# EAGLE design BT AQ DOL R1 (EAGLE 9.6.2)
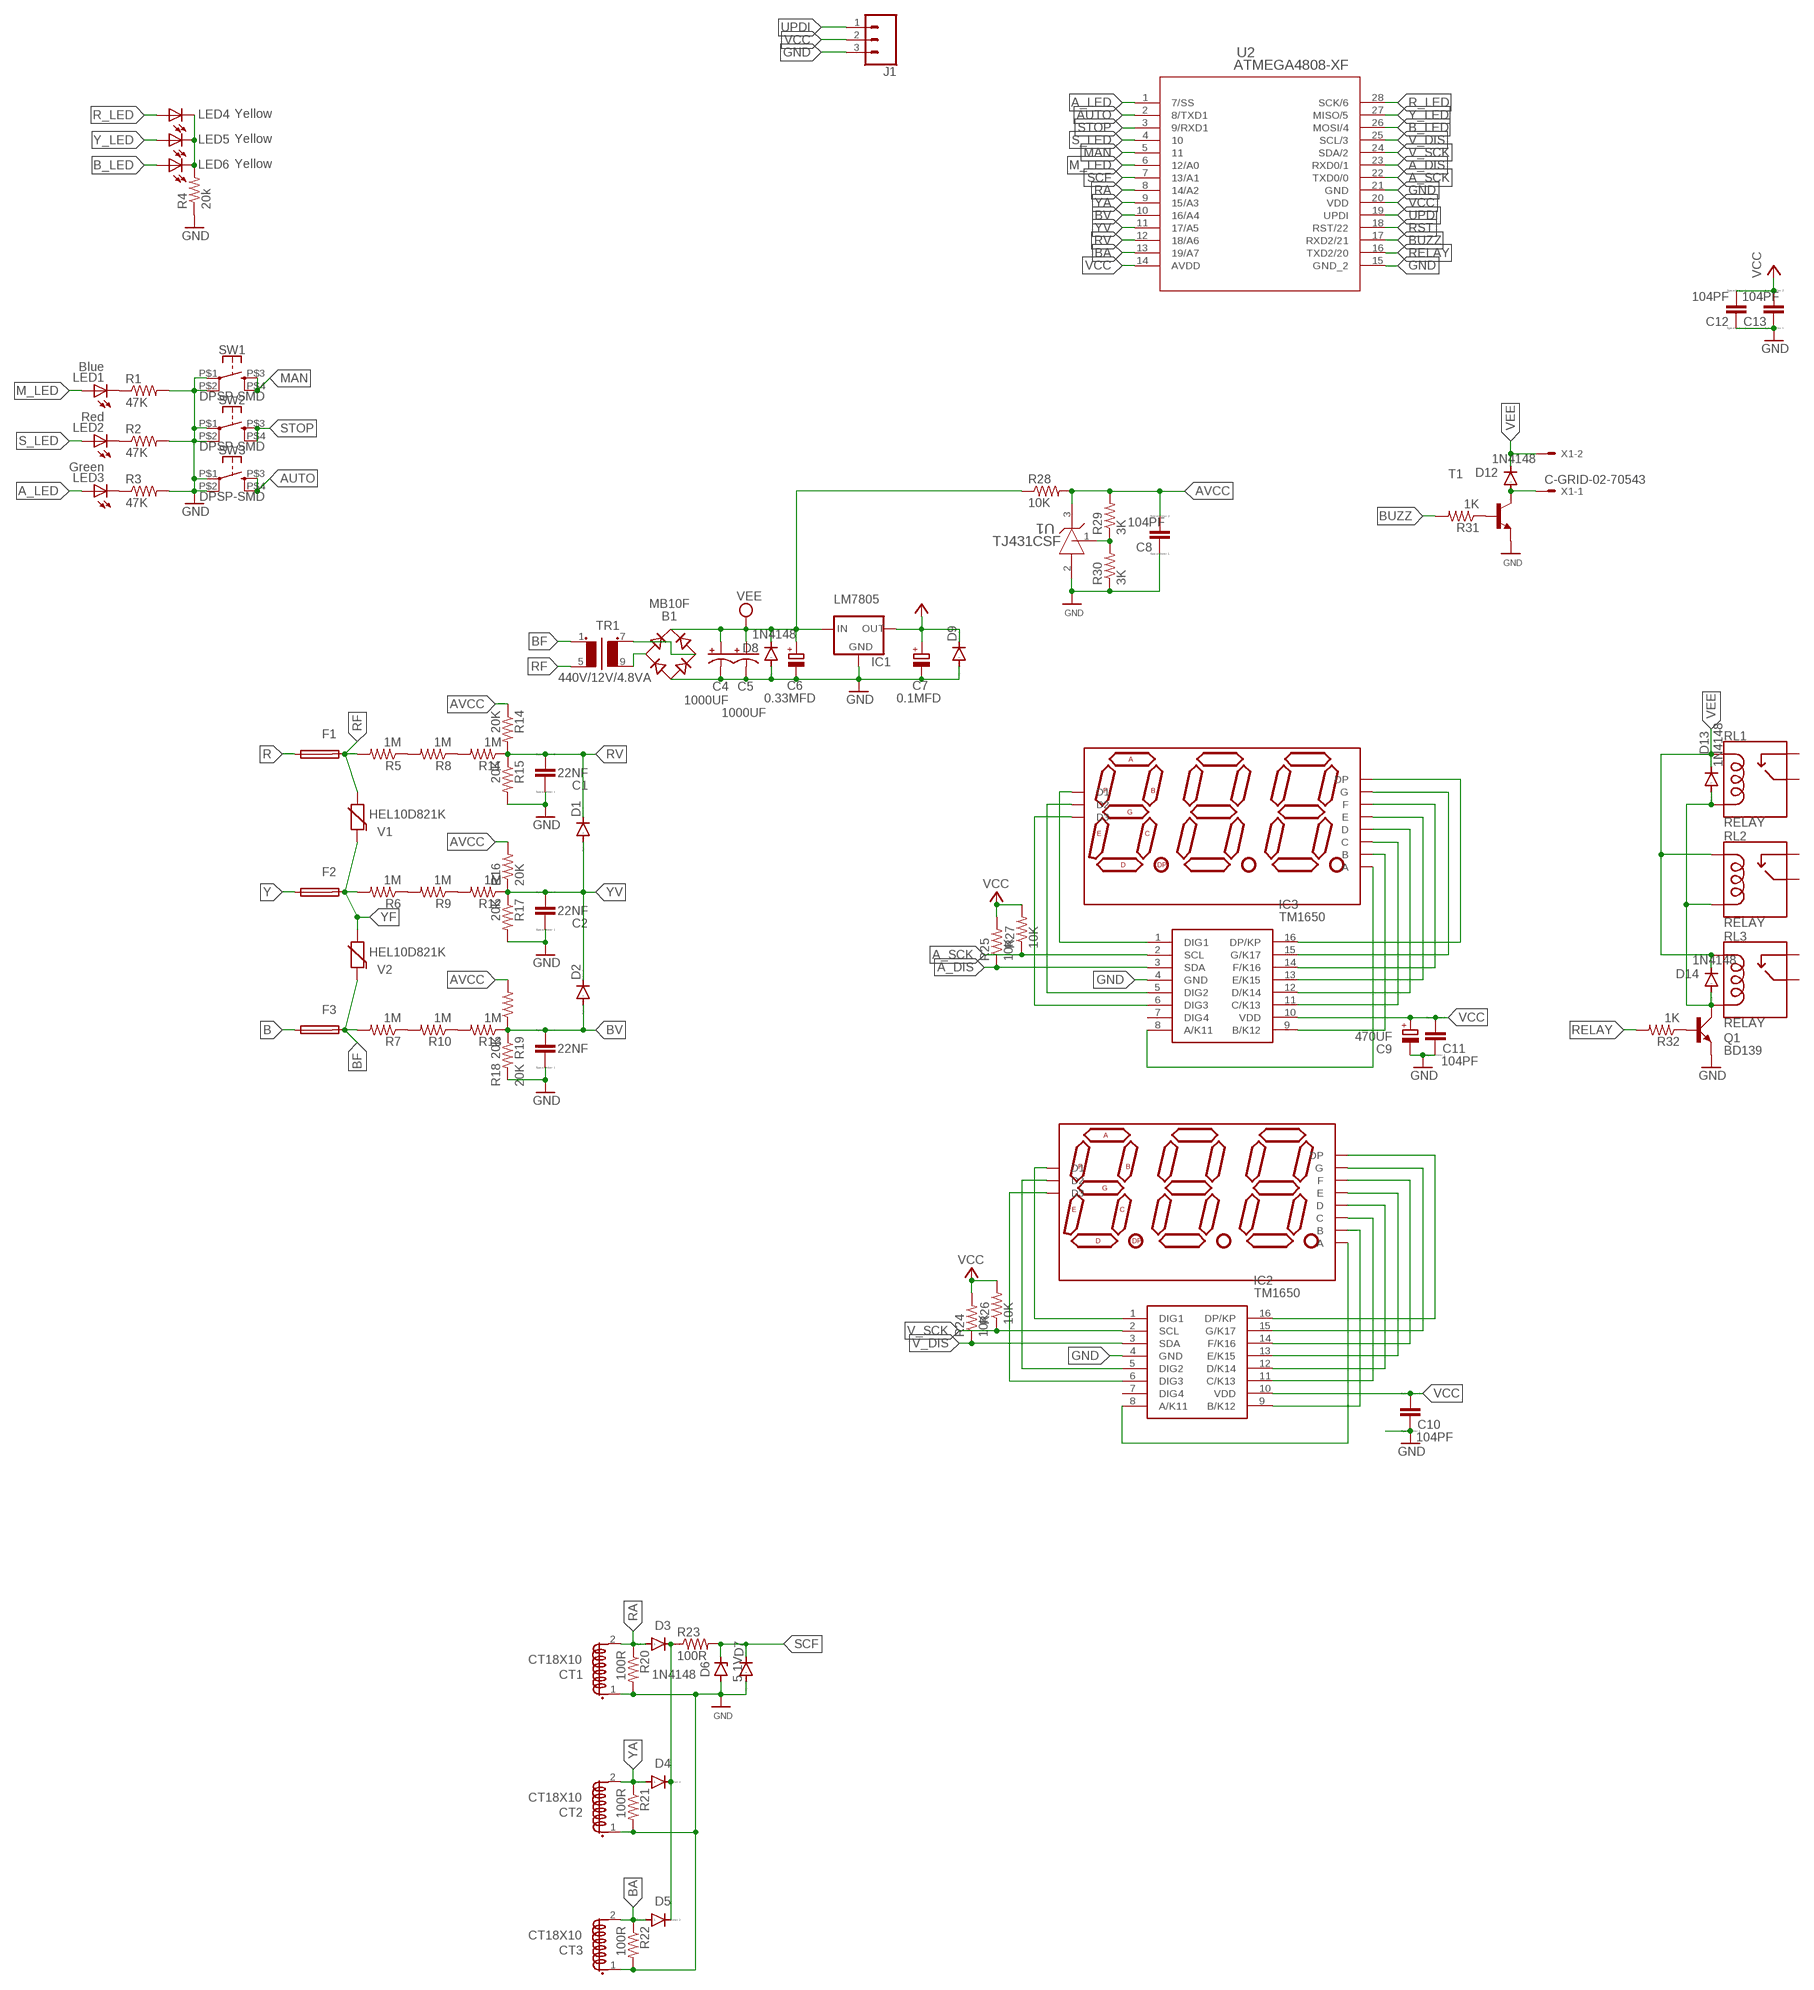
[diagram p0: schematic, sheet 1]

## Parts
B1  MB10F  MB8S  [SOIC-4]
C1  22NF  CC1206  [C1206]
C2  22NF  CC1206  [C1206]
C3  22NF  CC1206  [C1206]
C4  1000UF  CPOL-USE3.5-10  [E3,5-10]
C5  1000UF  CPOL-USE3.5-10  [E3,5-10]
C6  0.33MFD  CPOL-EUE2.5-5  [E2,5-5]
C7  0.1MFD  CPOL-EUE2.5-5  [E2,5-5]
C8  104PF  CC1206  [C1206]
C9  470UF  CPOL-EUE3.5-8  [E3,5-8]
C10  104PF  CC1206  [C1206]
C11  104PF  CC1206  [C1206]
C12  104PF  CC1206  [C1206]
C13  104PF  CC1206  [C1206]
CT1  CT18X10  [ZMCT103C]
CT2  CT18X10  [ZMCT103C]
CT3  CT18X10  [ZMCT103C]
D1  DIODE-DO214AA  [DO214AA]
D2  DIODE-DO214AA  [DO214AA]
D3  1N4148  DIODE-MINIMELF  [MINIMELF]
D4  1N4148  DIODE-MINIMELF  [MINIMELF]
D5  1N4148  DIODE-MINIMELF  [MINIMELF]
D6  5.1V  ZENER__DO-213AA(SOD-80)  [DIOMELF3516]
D7  DIODE-DO214AA  [DO214AA]
D8  1N4148  DIODE-MINIMELF  [MINIMELF]
D9  DIODE-DO214AA  [DO214AA]
D10  SUNR036CC3D  7SEGMENT-3DIGITDIP  [7S3D036_DIP]
D11  SUNR036CC3D  7SEGMENT-3DIGITDIP  [7S3D036_DIP]
D12  1N4148  DIODE-MINIMELF  [MINIMELF]
D13  1N4148  DIODE-DO-214AC  [DO-214AC]
D14  1N4148  DIODE-MINIMELF  [MINIMELF]
F1  TRF600-150  PPTCSMD  [TRF600-150-SMD]
F2  TRF600-150  PPTCSMD  [TRF600-150-SMD]
F3  TRF600-150  PPTCSMD  [TRF600-150-SMD]
IC1  LM7805  78XXS  [78XXS]
IC2  TM1650  [SOIC127P604X185-16N]
IC3  TM1650  [SOIC127P604X185-16N]
J1  CONN_03  [1X03]
LED1  Blue  LED3MM  [LED3MM]
LED2  Red  LED3MM  [LED3MM]
LED3  Green  LED3MM  [LED3MM]
LED4  Yellow  LED3MM  [LED3MM]
LED5  Yellow  LED3MM  [LED3MM]
LED6  Yellow  LED3MM  [LED3MM]
Q1  BD139  [TO126AV]
R1  47K  R-US_M1206  [M1206]
R2  47K  R-US_M1206  [M1206]
R3  47K  R-US_M1206  [M1206]
R4  20k  R-US_M1206  [M1206]
R5  1M  R-US_M1206  [M1206]
R6  1M  R-US_M1206  [M1206]
R7  1M  R-US_M1206  [M1206]
R8  1M  R-US_M1206  [M1206]
R9  1M  R-US_M1206  [M1206]
R10  1M  R-US_M1206  [M1206]
R11  1M  R-US_M1206  [M1206]
R12  1M  R-US_M1206  [M1206]
R13  1M  R-US_M1206  [M1206]
R14  20K  R-US_M1206  [M1206]
R15  20K  R-US_M1206  [M1206]
R16  20K  R-US_M1206  [M1206]
R17  20K  R-US_M1206  [M1206]
R18  20K  R-US_M1206  [M1206]
R19  20K  R-US_M1206  [M1206]
R20  100R  R-US_M1206  [M1206]
R21  100R  R-US_M1206  [M1206]
R22  100R  R-US_M1206  [M1206]
R23  100R  R-US_M1206  [M1206]
R24  10K  R-US_M1206  [M1206]
R25  10K  R-US_M1206  [M1206]
R26  10K  R-US_M1206  [M1206]
R27  10K  R-US_M1206  [M1206]
R28  10K  R-US_M1206  [M1206]
R29  3K  R-US_M1206  [M1206]
R30  3K  R-US_M1206  [M1206]
R31  1K  R-US_M1206  [M1206]
R32  1K  R-US_M1206  [M1206]
RL1  RELAY  [DT81_RECTANGULAR]
RL2  RELAY  [DT81_RECTANGULAR]
RL3  RELAY  [DT81_RECTANGULAR]
SW1  DPSP-SMD  [B3F-40XX-ROUND-SMD]
SW2  DPSP-SMD  [B3F-40XX-ROUND-SMD]
SW3  DPSP-SMD  [B3F-40XX-ROUND-SMD]
T1  MMUN2213LT1-NPN-SC59-BEC  [SC59-BEC]
TR1  440V/12V/4.8VA  TRANSFORMER6VA  [440V12V6VA]
U1  TJ431CSF  TJ431CSFDBZ0003A_L  [SOT-23]
U2  ATMEGA4808-XF  [SSOP28_SS_MCH]
V1  HEL10D821K  VARISTOR  [10MM]
V2  HEL10D821K  VARISTOR  [10MM]
X1  C-GRID-02-70543  [70543-02]

## Nets
A_DIS: IC3.3(SDA) R25.1 U2.23(RXD0/1)
A_LED: LED3.A U2.1(7/SS)
A_SCK: IC3.2(SCL) R27.1 U2.22(TXD0/0)
AUTO: SW3.P$3 SW3.P$4 U2.2(8/TXD1)
AVCC: C8.2 R14.1 R16.2 R18.2 R28.2 R29.2 U1.3(CATHODE)
B: F3.1
B_LED: LED6.A U2.26(MOSI/4)
BA: CT3.2(S1.2) D5.A R22.1 U2.13(19/A7)
BF: F3.2 R7.2 TR1.1 V2.1
BUZZ: R31.2 U2.17(RXD2/21)
BV: C3.2 D2.A R13.1 R18.1 R19.1 U2.10(16/A4)
GND: B1.- C1.1 C2.1 C3.1 C4.- C5.- C6.- C7.- C8.1 C9.- C10.1 C11.1 C12.1 C13.1 CT1.1(S1.1) CT2.1(S1.1) CT3.1(S1.1) D6.2(A) D7.A D8.A D9.A IC1.GND IC2.4(GND) IC3.4(GND) J1.3 Q1.E R1.2 R2.2 R3.2 R4.1 R15.2 R17.2 R19.2 R20.2 R21.2 R22.2 R30.1 SW1.P$1 SW1.P$2 SW2.P$1 SW2.P$2 SW3.P$1 SW3.P$2 T1.E U1.2(ANODE) U2.15(GND_2) U2.21(GND)
M_LED: LED1.A U2.6(12/A0)
MAN: SW1.P$3 SW1.P$4 U2.5
N$1: B1.~2(AC2) TR1.7(S1)
N$2: B1.~1(AC1) TR1.9(S2)
N$3: D12.A T1.C X1.1
N$4: R31.1 T1.B
N$5: LED3.K(C) R3.1
N$6: LED2.K(C) R2.1
N$8: LED1.K(C) R1.1
N$9: R29.1 R30.2 U1.1(REF)
N$13: R5.1 R8.2
N$14: R8.1 R11.2
N$15: R6.1 R9.2
N$18: R7.1 R10.2
N$19: R9.1 R12.2
N$22: Q1.B R32.1
N$23: R10.1 R13.2
N$28: D11.11(A) IC3.8(A/K11)
N$29: D11.7(B) IC3.9(B/K12)
N$30: D11.4(C) IC3.11(C/K13)
N$31: D11.2(D) IC3.12(D/K14)
N$32: D11.1(E) IC3.13(E/K15)
N$33: D11.10(F) IC3.14(F/K16)
N$34: D11.5(G) IC3.15(G/K17)
N$35: D11.3(DP) IC3.16(DP/KP)
N$36: D11.12(D1) IC3.1(DIG1)
N$37: D11.9(D2) IC3.5(DIG2)
N$38: D11.8(D3) IC3.6(DIG3)
N$39: D10.11(A) IC2.8(A/K11)
N$40: D10.7(B) IC2.9(B/K12)
N$41: D10.4(C) IC2.11(C/K13)
N$42: D3.C D4.C D5.C R23.1
N$44: D10.2(D) IC2.12(D/K14)
N$45: LED4.K(C) LED5.K(C) LED6.K(C) R4.2
N$48: D10.1(E) IC2.13(E/K15)
N$49: D10.10(F) IC2.14(F/K16)
N$50: D10.5(G) IC2.15(G/K17)
N$51: D10.3(DP) IC2.16(DP/KP)
N$52: D10.12(D1) IC2.1(DIG1)
N$53: D10.9(D2) IC2.5(DIG2)
N$54: D10.8(D3) IC2.6(DIG3)
N$121: D13.A D14.A Q1.C RL1.2(COIL2) RL1.2.(COIL2) RL2.2(COIL2) RL2.2.(COIL2) RL3.2(COIL2) RL3.2.(COIL2)
R: F1.1
R_LED: LED4.A U2.28(SCK/6)
RA: CT1.2(S1.2) D3.A R20.1 U2.8(14/A2)
RELAY: R32.2 U2.16(TXD2/20)
RF: F1.2 R5.2 TR1.5(P2) V1.2
RST: U2.18(RST/22)
RV: C1.2 D1.C R11.1 R14.2 R15.1 U2.12(18/A6)
S_LED: LED2.A U2.4
SCF: D6.1(C) D7.C R23.2 U2.7(13/A1)
STOP: SW2.P$3 SW2.P$4 U2.3(9/RXD1)
UPDI: J1.1 U2.19(UPDI)
V_DIS: IC2.3(SDA) R24.1 U2.25(SCL/3)
V_SCK: IC2.2(SCL) R26.1 U2.24(SDA/2)
VCC: C7.+ C9.+ C10.2 C11.2 C12.2 C13.2 D9.C IC1.OUT IC2.10(VDD) IC3.10(VDD) J1.2 R24.2 R25.2 R26.2 R27.2 U2.14(AVDD) U2.20(VDD)
VEE [VEE]: B1.+ C4.+ C5.+ C6.+ D8.C D12.C D13.C D14.C IC1.IN R28.1 RL1.1(COIL1) RL1.1.(COIL1) RL2.1(COIL1) RL2.1.(COIL1) RL3.1(COIL1) RL3.1.(COIL1) X1.2
Y: F2.1
Y_LED: LED5.A U2.27(MISO/5)
YA: CT2.2(S1.2) D4.A R21.1 U2.9(15/A3)
YF: F2.2 R6.2 V1.1 V2.2
YV: C2.2 D1.A D2.C R12.1 R16.1 R17.1 U2.11(17/A5)
Unconnected: IC2.7(DIG4) IC3.7(DIG4) RL1.C(MAIN) RL1.C.(MAIN) RL1.NO(N0) RL1.NO.(N0) RL2.C(MAIN) RL2.C.(MAIN) RL2.NO(N0) RL2.NO.(N0) RL3.C(MAIN) RL3.C.(MAIN) RL3.NO(N0) RL3.NO.(N0)

## Library data of the parts
B1 = rectifier:MB*S: Bridge Rectifier Source: http://www.fairchildsemi.com/ds/MB/MB6S.pdf
C1-C3 C8 C10-C13 = eagle-ltspice:C: CAPACITOR, European symbol; SPICEMODEL: NONE; SPICEPREFIX: C
C4 C5 = rcl:CPOL-US: POLARIZED CAPACITOR, American symbol; SPICEPREFIX: C
C6 C7 C9 = rcl:CPOL-EU: POLARIZED CAPACITOR, European symbol; SPICEPREFIX: C
CT1-CT3 = User Components:CT
D1-D5 D7-D9 D12-D14 = diode:DIODE-: DIODE
D6 = Tinkercad:ZENER: Zener Diode - Generic; CATEGORY: Diode; SUB-CATEGORY: Zener; VALUE: ZENER
D10 D11 = User Components:7SEGMENT-3DIGIT
F1-F3 = User Components:PPTC: FUSE Wickmann
IC1 = v-reg:78XXS: VOLTAGE REGULATOR
IC2 IC3 = User Components:TM1650: The TM1650 is a dedicated LED (LED display) drive control circuit with a keyboard scan interface. The MCU input and output control digital interface, data latch, LED driver, keyboard scan, brightness adjustment and other circuits are integrated inside. The TM1650's stable performance, reliable quality, and high immunity to interference make it suitable for long-term continuous operation in 24 hours Source: Datasheet <http://www.titanmec.com/index.php/en/product/download/id/540.html>; DESCRIPTION: The TM1650 is a dedicated LED (LED display) drive control circuit with a keyboard scan interface. The MCU input and output control digital interface, data latch, LED driver, keyboard scan, brightness adjustment and other circuits are integrated inside. The TM1650's stable performance, reliable quality, and high immunity to interference make it suitable for long-term continuous operation in 24 hours; HEIGHT: 1.85mm; MANUFACTURER_NAME: TITAN MICRO ELECTRONICS; MANUFACTURER_PART_NUMBER: tm1650
J1 = SparkFun-Connectors:CONN_03: Multi connection point. Often used as Generic Header-pin footprint for 0.1 inch spaced/style header connections On any of the 0.1 inch spaced packages, you can populate with these: Break Away Headers - Straight <https://www.sparkfun.com/products/116> (PRT-00116) Break Away Male Headers - Right Angle <https://www.sparkfun.com/products/553> (PRT-00553) Female Headers <https://www.sparkfun.com/products/115> (PRT-00115) Break Away Headers - Machine Pin <https://www.sparkfun.com/products/117> (PRT-00117) Break Away Female Headers - Swiss Machine Pin <https://www.sparkfun.com/products/743> (PRT-00743) Stackable Header - 3 Pin (Female, 0.1") <https://www.sparkfun.com/products/13875> (PRT-13875) For SCREWTERMINALS and SPRING TERMINALS visit here: Screw Terimnals on SparkFun.com <https://www.sparkfun.com/search/results?term=Screw+Terminals> (5mm/3.5mm/2.54mm spacing) This device is also useful as a general connection point to wire up your design to another part of your project. Our various solder wires solder well into these plated through hole pads. Hook-Up Wire - Assortment (Stranded, 22 AWG) <https://www.sparkfun.com/products/11375> (PRT-11375) Hook-Up Wire - Assortment (Solid Core, 22 AWG) <https://www.sparkfun.com/products/11367> (PRT-11367) View the entire wire category on our website here <https://www.sparkfun.com/categories/141> Special notes: Molex polarized connector foot print use with SKU : PRT-08232 with associated crimp pins and housings.
LED1-LED6 = adafruit:LED: LED OSRAM: - CHIPLED LG R971, LG N971, LY N971, LG Q971, LY Q971, LO R971, LY R971 LH N974, LH R974 LS Q976, LO Q976, LY Q976 LO Q996 - Hyper CHIPLED LW Q18S LB Q993, LB Q99A, LB R99A - SideLED LS A670, LO A670, LY A670, LG A670, LP A670 LB A673, LV A673, LT A673, LW A673 LH A674 LY A675 LS A676, LA A676, LO A676, LY A676, LW A676 LS A679, LY A679, LG A679 - Hyper Micro SIDELED® LS Y876, LA Y876, LO Y876, LY Y876 LT Y87S - SmartLED LW L88C, LW L88S LB L89C, LB L89S, LG L890 LS L89K, LO L89K, LY L89K LS L896, LA L896, LO L896, LY L896 - TOPLED LS T670, LO T670, LY T670, LG T670, LP T670 LSG T670, LSP T670, LSY T670, LOP T670, LYG T670 LG T671, LOG T671, LSG T671 LB T673, LV T673, LT T673, LW T673 LH T674 LS T676, LA T676, LO T676, LY T676, LB T676, LH T676, LSB T676, LW T676 LB T67C, LV T67C, LT T67C, LS T67K, LO T67K, LY T67K, LW E67C LS E67B, LA E67B, LO E67B, LY E67B, LB E67C, LV E67C, LT E67C LW T67C LS T679, LY T679, LG T679 LS T770, LO T770, LY T770, LG T770, LP T770 LB T773, LV T773, LT T773, LW T773 LH T774 LS E675, LA E675, LY E675, LS T675 LS T776, LA T776, LO T776, LY T776, LB T776 LHGB T686 LT T68C, LB T68C - Hyper Mini TOPLED® LB M676 - Mini TOPLED Santana® LG M470 LS M47K, LO M47K, LY M47K Source: http://www.osram.convergy.de/
Q1 = transistor-power:BD139: NPN TRANSISTOR
R1-R19 R24-R27 R31 R32 = rcl:R-US_: RESISTOR, American symbol; SPICEPREFIX: R
R20-R23 R28-R30 = rcl:R-US_: RESISTOR, American symbol
RL1-RL3 = User Components:RELAY
SW1-SW3 = User Components:DPSP-SMD
T1 = transistor:*-NPN-: NPN Transistror BF959 corrected 2008.03.06
TR1 = User Components:TRANSFORMER
U1 = User Components:TJ431CSF; COPYRIGHT: Copyright (C) 2022 Ultra Librarian. All rights reserved.; MANUFACTURER_PART_NUMBER: TL431IDBZTG4; MFR_NAME: Texas Instruments; REFDES: RefDes; TYPE: TYPE
U2 = User Components:ATMEGA4808-XF; COPYRIGHT: Copyright (C) 2022 Ultra Librarian. All rights reserved.; MANUFACTURER_PART_NUMBER: ATMEGA4808-XF; MFR_NAME: Microchip
V1 V2 = User Components:VARISTOR
X1 = con-molex:C-GRID-02: CONNECTOR wire to board 2.54 mm (0.100") pitch header; MF: MOLEX; OC_FARNELL: unknown; OC_NEWARK: unknown

## Net classes
0 default: width 0.254 mm, drill 0.508 mm, clearance 0.381 mm
1 VEE: width 0.762 mm, drill 0.508 mm, clearance 0.508 mm

## Board
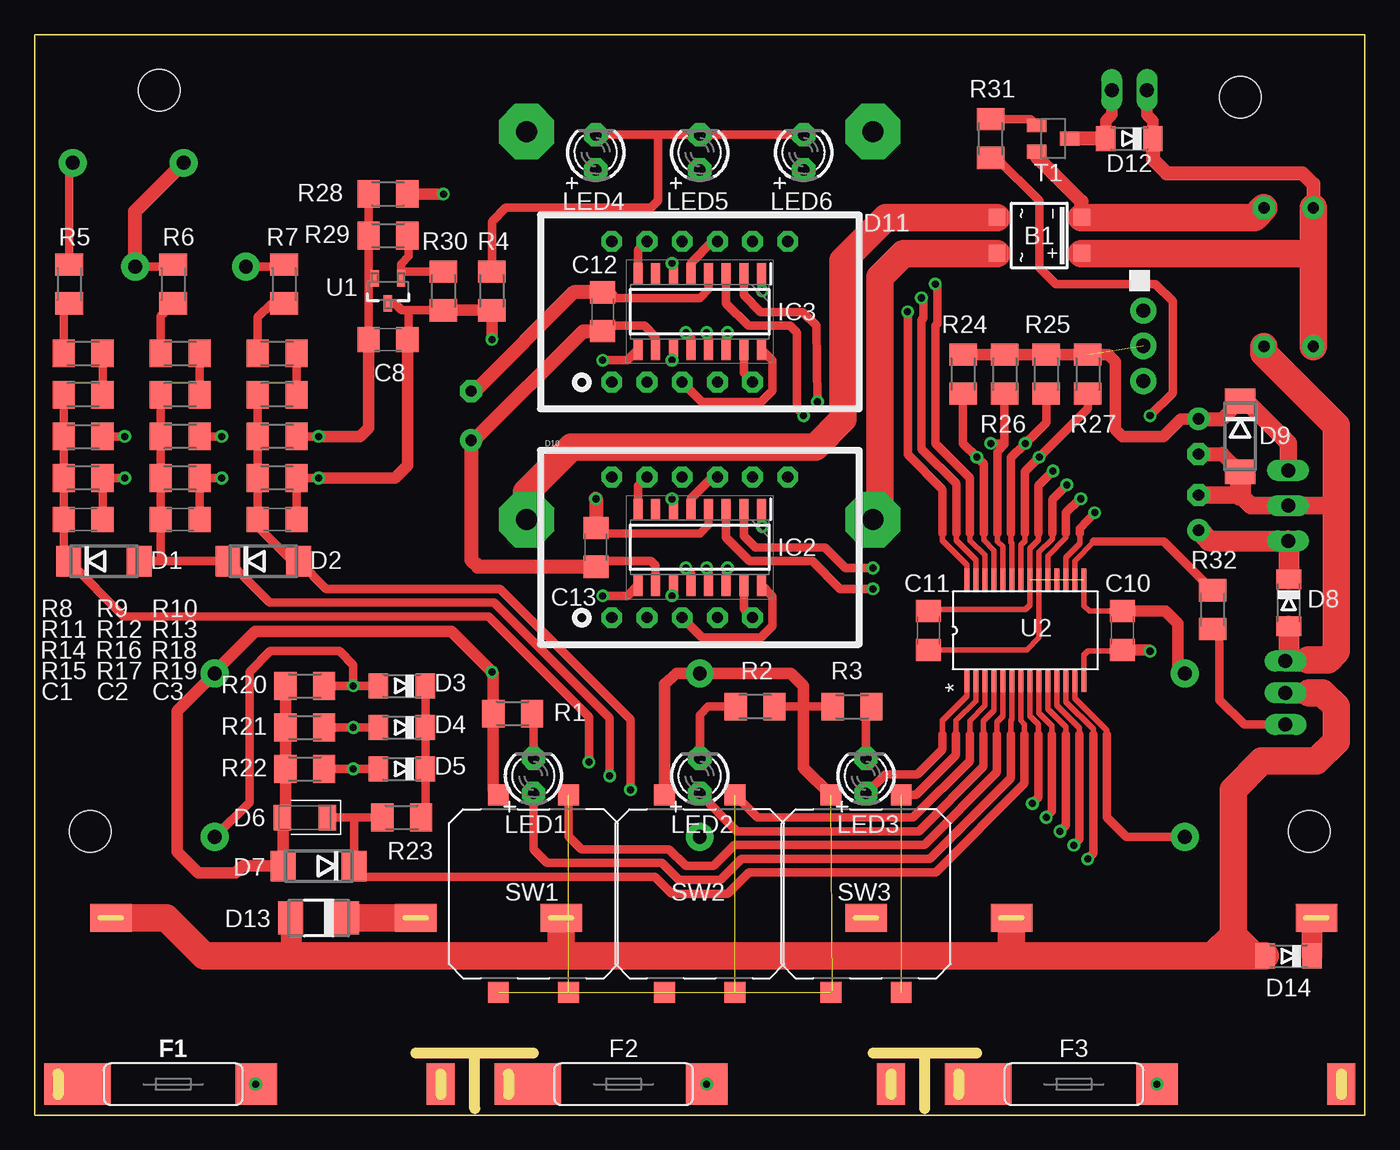
[diagram p1: board, top side]
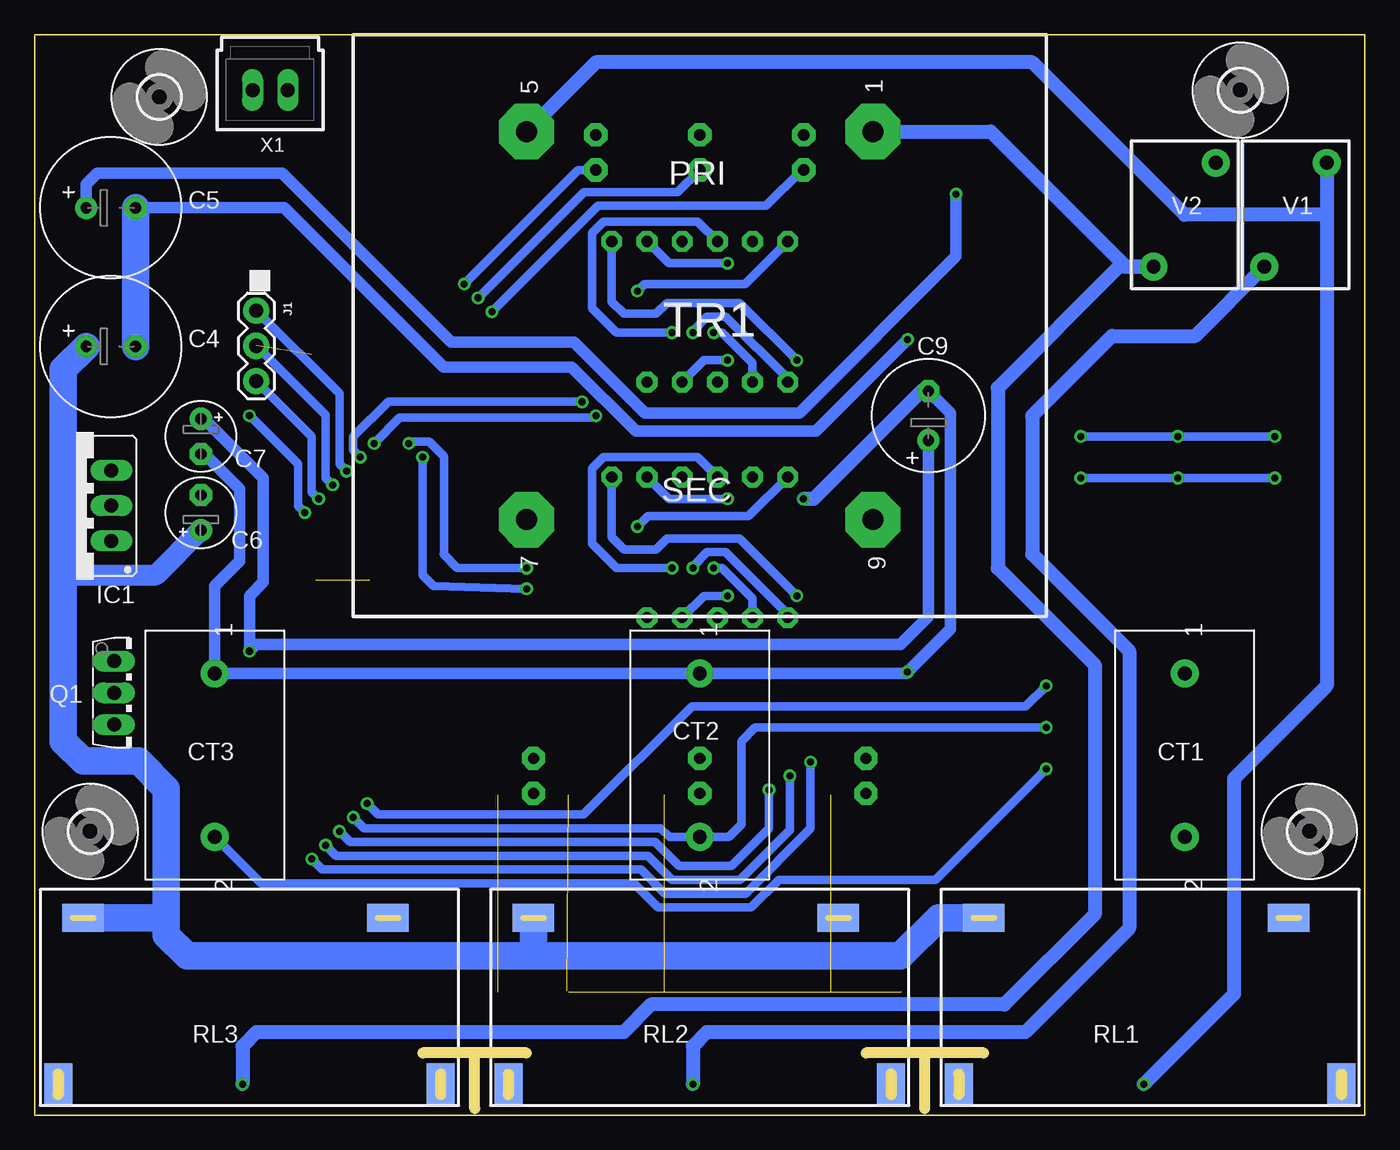
[diagram p2: board, bottom side, seen from below]

Size 96 x 78 mm. Coordinates in mm from the lower left corner, seen from the top.
Outline: 96,0 96,78 0,78 0,0 96,0
Copper layers (1*16): Top 0.035mm / dielectric 1.5mm / Bottom 0.035mm
Design rules "default *": minimum track width 6mil, minimum drill 0.35mm, track to track 6mil, track to pad 6mil, pad to pad 6mil, via to via 6mil, smd to smd 6mil, copper to edge 40mil, drill to drill 6mil, minimum pad ring 10mil, minimum via ring 8mil, stop-mask expansion 4mil, vias tented up to drill 20mil, thermal gap 10mil
Milling: 6 lines

### Footprints (pad centres in the part's own frame; a part is rotated, then mirrored left to right if it is on the bottom)
SOIC-4 = smd 1.2 x 1.2: + 1.3,3.05; - -1.3,3.05; ~1 -1.3,-3.05; ~2 1.3,-3.05
C1206 = smd 1.6 x 1.8: 1 -1.4,0; 2 1.4,0
E3,5-10 = drill 0.813 pad 1.6: + -1.778,0 | drill 0.813 pad 1.6 octagon: - 1.778,0
E2,5-5 = drill 0.813 pad 1.6: + -1.27,0 | drill 0.813 pad 1.6 octagon: - 1.27,0
E3,5-8 = drill 0.813 pad 1.6: + -1.778,0 | drill 0.813 pad 1.6 octagon: - 1.778,0
ZMCT103C = drill 1 pad 2: 1 -5.9,0; 2 5.9,0
DO214AA = smd 1.8 x 2.2: A 2.55,0; C -2.55,0
MINIMELF = smd 1.4 x 1.8: A 1.7,0; C -1.7,0
DIOMELF3516 = smd 1.275 x 1.85: 1 -1.62,0; 2 1.62,0
7S3D036_DIP = drill 0.8 pad 1.5 octagon: 1 -6.35,-5.08; 2 -3.81,-5.08; 3 -1.27,-5.08; 4 1.27,-5.08; 5 3.81,-5.08; 7 6.35,5.08; 8 3.81,5.08; 9 1.27,5.08; 10 -1.27,5.08; 11 -3.81,5.08; 12 -6.35,5.08
DO-214AC = smd 1.8 x 2.4: A 2.025,0; C -2.025,0
TRF600-150-SMD = smd 3 x 3: 1 -6,0; 2 6,0
78XXS = drill 1.016 long: GND 0,-2.54; IN -2.54,-2.54; OUT 2.54,-2.54
SOIC127P604X185-16N = smd 1.53 x 0.65: 1 -2.735,4.445; 2 -2.735,3.175; 3 -2.735,1.905; 4 -2.735,0.635; 5 -2.735,-0.635; 6 -2.735,-1.905; 7 -2.735,-3.175; 8 -2.735,-4.445; 9 2.735,-4.445; 10 2.735,-3.175; 11 2.735,-1.905; 12 2.735,-0.635; 13 2.735,0.635; 14 2.735,1.905; 15 2.735,3.175; 16 2.735,4.445
1X03 = drill 1.016 pad 1.88: 1 0,0; 2 2.54,0; 3 5.08,0
LED3MM = drill 0.813 pad 1.676 octagon: A -1.27,0; K 1.27,0
TO126AV = drill 1.016 long: B 2.286,-1.27; C 0,-1.27; E -2.286,-1.27
M1206 = smd 1.6 x 2: 1 -1.4,0; 2 1.4,0
DT81_RECTANGULAR = smd 3 x 2: 1 12,-5.75; 2 -10,-5.75 | smd 3 x 2 bottom: 1. 12,-5.75; 2. -10,-5.75 | smd 2 x 3: C -13.8,6.25; NO 13.8,6.25 | smd 2 x 3 bottom: C. -13.8,6.25; NO. 13.8,6.25
B3F-40XX-ROUND-SMD = smd 1.5 x 1.5: P$1 -7.12,2.54; P$2 7.12,2.54; P$3 -7.12,-2.54; P$4 7.12,-2.54
SC59-BEC = smd 1 x 1.4: B -0.95,-1.2; C 0,1.2; E 0.95,-1.2
440V12V6VA = drill 1.5 pad 4 octagon: 1 -14,12.5; 5 -14,-12.5; 7 14,-12.5; 9 14,12.5
SOT-23 = smd 0.6 x 1.2: 1 -0.95,-0.9; 2 0,0.9; 3 0.95,-0.9
SSOP28_SS_MCH = smd 1.651 x 0.381: 1 -3.632,4.225; 2 -3.632,3.575; 3 -3.632,2.925; 4 -3.632,2.275; 5 -3.632,1.625; 6 -3.632,0.975; 7 -3.632,0.325; 8 -3.632,-0.325; 9 -3.632,-0.975; 10 -3.632,-1.625; 11 -3.632,-2.275; 12 -3.632,-2.925; 13 -3.632,-3.575; 14 -3.632,-4.225; 15 3.632,-4.225; 16 3.632,-3.575; 17 3.632,-2.925; 18 3.632,-2.275; 19 3.632,-1.625; 20 3.632,-0.975; 21 3.632,-0.325; 22 3.632,0.325; 23 3.632,0.975; 24 3.632,1.625; 25 3.632,2.275; 26 3.632,2.925; 27 3.632,3.575; 28 3.632,4.225
3,0 = hole 3: 0,0
10MM = drill 1 pad 2: 1 -3.75,2.25; 2 3.75,-2.25
70543-02 = drill 1.016 long: 1 -1.27,0; 2 1.27,0

### Placement (x,y rotation side)
B1  72.5,63.5 270 top
C1  3.5,43 180 top
C2  10.5,43 180 top
C3  17.5,43 180 top
C4  90.5,55.5 0 bottom
C5  90.5,65.5 0 bottom
C6  84,43.5 90 bottom
C7  84,49 270 bottom
C8  25.5,56 180 top
C9  31.5,50.5 90 bottom
C10  78.5,35 270 top
C11  64.5,35 270 top
C12  41,58 270 top
C13  40.5,41 270 top
CT1  13,26 270 bottom
CT2  48,26 270 bottom
CT3  83,26 270 bottom
D1  5,40 0 top
D2  16.5,40 0 top
D3  26.5,31 180 top
D4  26.5,28 180 top
D5  26.5,25 180 top
D6  19.5,21.5 180 top
D7  20.5,18 180 top
D8  90.5,37 270 top
D9  87,49 270 top
D10  48,41 0 top
D11  48,58 0 top
D12  79,70.5 180 top
D13  20.5,14.25 180 top
D14  90.5,11.5 180 top
F1  10,2.25 0 top
F2  42.5,2.25 0 top
F3  75,2.25 0 top
IC1  93,44 90 bottom
IC2  48,41 270 top
IC3  48,58 270 top
J1  80,53 90 bottom
LED1  36,24.5 90 top
LED2  48,24.5 90 top
LED3  60,24.5 90 top
LED4  40.5,69.5 90 top
LED5  48,69.5 90 top
LED6  55.5,69.5 90 top
Q1  89,30.5 270 bottom
R1  34.5,29 180 top
R2  52,29.5 0 top
R3  59,29.5 180 top
R4  33,59.5 90 top
R5  2.5,60 90 top
R6  10,60 90 top
R7  18,60 90 top
R8  3.5,55 180 top
R9  10.5,55 180 top
R10  17.5,55 180 top
R11  3.5,52 0 top
R12  10.5,52 0 top
R13  17.5,52 0 top
R14  3.5,49 180 top
R15  3.5,46 0 top
R16  10.5,49 0 top
R17  10.5,46 0 top
R18  17.5,49 0 top
R19  17.5,46 0 top
R20  19.5,31 180 top
R21  19.5,28 180 top
R22  19.5,25 180 top
R23  26.5,21.5 180 top
R24  67,53.5 90 top
R25  73,53.5 90 top
R26  70,53.5 90 top
R27  76,53.5 90 top
R28  25.5,66.5 180 top
R29  25.5,63.5 180 top
R30  29.5,59.5 90 top
R31  69,70.5 270 top
R32  85,36.5 90 top
RL1  15.5,8.5 180 bottom
RL2  48,8.5 180 bottom
RL3  80.5,8.5 180 bottom
SW1  36,16 90 top
SW2  48,16 90 top
SW3  60,16 90 top
T1  73.5,70.5 270 top
TR1  48,57 270 bottom
U1  25.5,59.5 180 top
U2  71.5,35 90 top
U$1  [3,0]  92,20.5 0 bottom
U$2  [3,0]  4,20.5 0 bottom
U$3  [3,0]  87,73.5 0 bottom
U$8  [3,0]  9,74 0 bottom
V1  5,65 90 bottom
V2  13,65 90 bottom
X1  79,74 180 bottom

### Tracks (layer width: path | path; a pad name or v marks a point on that pad's centre or on a via)
A_DIS  (via drill 0.51)
  Top 0.38: 70.47,42 70.47,41.36 70.53,41.3 U2.23
  Top 0.61: IC3.3 49.91,58.59 51.5,57 54.5,57 55,56.5 55,51 v55.5,50.5 | 70.47,42 70.47,47.47 v71.5,48.5 73,50 R25.1
  Bottom 0.61: v71.5,48.5 69.64,50.36 55.64,50.36 v55.5,50.5
A_LED
  Top 0.38: U2.1 67.28,30.27 65.5,28.5 65.5,27.5
  Top 0.61: LED3.A 61.38,24.61 63.7,24.61 65.5,26.41 65.5,27.5
A_SCK  (via drill 0.51)
  Top 0.38: U2.22 71.17,40.76 71.17,41.17 71.46,41.46 71.46,42
  Top 0.61: IC3.2 51.17,59.21 52.39,57.99 55.41,57.99 56.42,56.98 v56.5,51.5 | 71.46,42 71.46,46.46 v72.5,47.5 76,51 R27.1
  Bottom 0.61: v72.5,47.5 73,48 73,49 70.47,51.53 v56.5,51.5
AUTO  (1 unrouted)
  Top 0.38: U2.2 67.92,29.93 66.49,28.49 66.49,27.5
  Top 0.61: SW3.P$4 63.61,23.12 66.49,26 66.49,27.5
AVCC  (via drill 0.51)
  Top 0.61: R14.1 v6.5,49 | v13.5,49 R16.2 | R18.2 v20.5,49 | 24.1,60.5 R29.2 R28.2 | 24.1,60.5 C8.2 | U1.3 24.2,60.4 24.1,60.5
  Top 0.813: v20.5,49 23.5,49 24.1,49.6 C8.2
  Bottom 0.61: v6.5,49 v13.5,49 v20.5,49
B_LED  (via drill 0.51)
  Top 0.38: U2.26 68.58,40.42 67.5,41.5 67.5,42
  Top 0.61: 67.5,42 67.5,46 65,48.5 65,56.98 65.14,57.13 65.14,59.86 v65,60
  Bottom 0.61: v65,60 56.77,68.23 LED6.A
BA  (via drill 0.51)
  Top 0.38: U2.13 75.08,30.1 77.39,27.79 77.39,27.5
  Top 0.61: CT3.2 78.79,20.1 77.39,21.5 77.39,27.5 | R22.1 v23,25 D5.A
  Bottom 0.61: v23,25 31,17 42.3,17 44.3,15 51,15 52.75,16.75 79.65,16.75 CT3.2
BF  (via drill 0.51)
  Top 0.61: V2.1 17.85,61.25 R7.2
  Bottom 1: F3.2 81,5 80,6 53.5,6 51.5,8 26,8 19.5,14.5 19.5,32.5 26.5,39.5 26.5,52.5 17.75,61.25 V2.1 17.25,61.25 27,71 TR1.1
  other vias: 81,2.25
BUZZ  (via drill 0.51)
  Top 0.38: U2.17 74.42,40.27 75.42,41.27 75.42,42
  Top 0.61: v76.5,43.5 75.42,42.34 75.42,42 | R31.2 69.4,69.1 72.5,66 72.5,61.19 73.69,60 80.88,60 82.13,58.75 82.13,52.13 v80.5,50.5
  Bottom 0.61: v80.5,50.5 76.99,46.99 76.99,43.99 v76.5,43.5
BV  (via drill 0.51)
  Top 0.38: U2.10 73.12,29.32 74.42,28.03 74.42,27.5
  Top 0.61: R13.1 R18.1 R19.1 C3.2 16.1,42.5 18.6,40 D2.A 21.05,38 33.57,38 43,28.57 v43,23.5 | v74,20.5 74.42,20.91 74.42,27.5
  Bottom 0.61: v43,23.5 43,20.72 45.72,18 49.5,18 51.23,19.73 73.22,19.73 v74,20.5
GND  (via drill 0.51)  (4 unrouted)
  Top 0.38: 72.45,42 72.45,41.54 71.83,40.91 U2.21 71.83,36.83 71.5,36.5 64.6,36.5 C11.1 | U2.15 75.72,36.77 76.1,36.4 C10.1
  Top 0.61: IC3.4 48.63,59.63 48,59 42,59 41.6,59.4 C12.1 | IC2.4 48.63,42.63 48,42 40.9,42 C13.1 40.12,42.78 | v73.5,46.5 72.45,45.45 72.45,42 | 27,56.5 27,56 C8.1 27,56.1 27,58.1 | R30.1 27,58.1 | 27,58.1 26.5,58.1 26,58.6 U1.2 | R2.2 55.5,29.5 R3.2 | C1.1 R15.2 v6.5,46 | C2.1 R17.2 v13.5,46 | C3.1 R19.2 v20.5,46
  Top 0.813: 78.9,36 C10.1 81.6,36.4 82.5,35.5 82.5,32.4 CT3.1 | SW3.P$2 55.5,25.08 55.5,29.5 55.5,31 54.6,31.9 CT2.1 46.34,31.9 45.46,31.15 SW2.P$2 | SW3.P$1 57.58,9 | R20.2 R22.2 R21.2 18.1,21.72 D6.2 17.95,21.43 D7.A 15,18 14.5,17.5 11.8,17.5 10.3,19 10.3,29.2 CT1.1 13,32 15.92,34.92 30.08,34.92 v33,32 33.1,31.9 R1.2 33.1,23.48 SW1.P$2 | C8.1 26.9,46.9 26,46 v20.5,46 | 91.91,32.88 90.64,32.88 90.5,33.02 | R30.1 R4.1 v33,56
  Top 1: C7.- 85.72,47.73 D9.A
  Top 1.016: B1.- 75.55,65.95 72.3,69.2 T1.E | C12.1 38.9,59.4 31.78,52.28 C9.- | v40.5,44.5 C13.1
  Top 1.27: 94.3,44 93.93,44 IC1.GND 87.77,44 87,44.77 C6.-
  Top 1.5: 94,37.43 93.93,37.5 | D9.A 87,44.77 | D8.A 90.5,33.02 Q1.E 92.41,32.79
  Top 2: C4.- 88.72,55 93.93,49.79 93.93,44 93.93,37.5 93.93,33.5 93.31,32.88 91.91,32.88 | B1.- 88.02,64.8 C5.-
  Bottom 0.61: v73.5,46.5 74,47 74,52.08 J1.3 | v6.5,46 v13.5,46 v20.5,46
  Bottom 0.813: C5.- 78,65.5 66.5,54 57.24,54 52.62,49.38 39.62,49.38 v33,56 | C9.- 29.91,50.69 29.91,35.09 v33,32 33.1,31.9 CT2.1 CT3.1 83,38.19 81.19,40 81.19,45.19 83.73,47.73 C7.-
  Bottom 1.016: C9.- 32,52.28 39.78,44.5 v40.5,44.5
  Bottom 2: C5.- C4.-
M_LED
  Top 0.38: U2.6 70.53,28.56 70.45,28.49 70.45,27.5
  Top 0.61: LED1.A 36,19.19 36.98,18.21 45.29,18.21 46.5,17 49.5,17 51.03,18.53 64.62,18.53 70.45,24.36 70.45,27.5
MAN  (1 unrouted)
  Top 0.38: U2.5 69.88,28.82 69.46,28.41 69.46,27.5
  Top 0.61: SW1.P$4 38.54,20.12 39.46,19.2 45.8,19.2 47,18 49,18 50.52,19.52 64.21,19.52 69.46,24.77 69.46,27.5
N$1
  Top 2: TR1.7 61,43.5 61,60.5 62.7,62.2 B1.~2
N$2
  Top 2: TR1.9 35.5,45 38.75,48.25 56.35,48.25 58.34,50.24 58.34,61.7 61.43,64.8 B1.~1
N$3
  Top 0.813: X1.1 77.73,72.23 77.3,71.8 D12.A
  Top 1.016: D12.A T1.C
N$4
  Top 0.61: R31.1 71.85,71.9 T1.B
N$5
  Top 0.61: R3.1 60,29.1 LED3.K
N$6
  Top 0.61: LED2.K 48,28.9 48.6,29.5 R2.1
N$8
  Top 0.61: R1.1 36,28.9 LED1.K
N$9
  Top 0.61: U1.1 26.45,61 | 26.45,61 26.45,61.45 27,62 27,63.4 R29.1 | R30.2 26.55,60.9 26.45,61
N$13
  Top 0.61: R5.1 2.1,58.2 R8.2
N$14
  Top 0.61: R11.2 R8.1
N$15
  Top 0.61: R9.2 9.1,57.7 R6.1
N$18
  Top 0.61: R7.1 17.1,58.6 16.1,57.6 R10.2
N$19
  Top 0.61: R9.1 R12.2
N$22
  Top 0.61: R32.1 85.5,34.6 85.5,30 87.29,28.21 Q1.B
N$23
  Top 0.61: R13.2 R10.1
N$28
  Top 0.61: D11.11 43.55,62.45 IC3.8
N$29  (via drill 0.51)
  Top 0.61: IC3.9 42.79,54.5 v41,54.5
  Bottom 0.61: D11.7 54.35,58.73 53.47,57.86 51.14,57.86 50.37,58.63 45.13,58.63 v41,54.5
N$30  (via drill 0.51)
  Top 0.61: IC3.11 46.09,54.59 v46,54.5
  Bottom 0.61: v46,54.5 47.69,54.5 D11.4
N$31  (via drill 0.51)
  Top 0.61: IC3.12 47.37,56.02 47.36,56.03 47.36,56.14 v47,56.5
  Bottom 0.61: v47,56.5 46.38,56.5 44.19,54.31 D11.2
N$32  (via drill 0.51)
  Top 0.61: IC3.13 48.63,56.37 v48.5,56.5
  Bottom 0.61: D11.1 41.65,53.17 46.13,57.64 47.47,57.64 48.5,56.62 v48.5,56.5
N$33  (via drill 0.51)
  Top 0.61: IC3.14 49.91,56.41 v50,56.5
  Bottom 0.61: D11.10 48.17,64.52 54.95,64.52 55.79,63.67 55.79,58.27 54.02,56.5 v50,56.5
N$34
  Top 0.61: D11.5 51.17,53.55 IC3.15
N$35
  Top 0.61: IC3.16 53.25,54.46 53.25,52.33 52.41,51.48 48.17,51.48 D11.3
N$36  (via drill 0.51)
  Top 0.61: v52.5,59.5 52.45,59.55 IC3.1
  Bottom 0.61: v52.5,59.5 52,60 44.73,60 D11.12
N$37
  Top 0.61: D11.9 48.92,63.08 47.37,61.52 IC3.5
N$38  (via drill 0.51)
  Top 0.61: IC3.6 46.09,61.41 v46,61.5
  Bottom 0.61: v46,61.5 50.23,61.5 D11.8
N$39
  Top 0.61: IC2.8 43.55,45.45 D10.11
N$40  (via drill 0.51)
  Top 0.61: IC2.9 42.79,37.5 v41,37.5
  Bottom 0.61: D10.7 54.35,41.73 53.47,40.86 51.14,40.86 50.37,41.63 45.13,41.63 v41,37.5
N$41  (via drill 0.51)
  Top 0.61: IC2.11 46.09,37.59 v46,37.5
  Bottom 0.61: D10.4 47.69,37.5 v46,37.5
N$42
  Top 0.61: D3.C D4.C D5.C 28.2,21.8 R23.1
N$44  (via drill 0.51)
  Top 0.61: IC2.12 47.37,39.02 47.36,39.03 47.36,39.14 v47,39.5
  Bottom 0.61: v47,39.5 46.38,39.5 44.19,37.31 D10.2
N$45
  Top 0.61: LED4.K 45,70.77 | 45,70.77 LED5.K LED6.K | 45,70.77 45,66 44.5,65.5 34,65.5 33,64.5 R4.2
N$48  (via drill 0.51)
  Top 0.61: IC2.13 48.63,39.37 v48.5,39.5
  Bottom 0.61: D10.1 41.65,36.17 46.13,40.64 47.47,40.64 48.5,39.62 v48.5,39.5
N$49  (via drill 0.51)
  Top 0.61: IC2.14 49.91,39.41 v50,39.5
  Bottom 0.61: D10.10 48.17,47.52 54.95,47.52 55.79,46.67 55.79,41.27 54.02,39.5 v50,39.5
N$50
  Top 0.61: IC2.15 51.17,36.55 D10.5
N$51
  Top 0.61: IC2.16 53.25,37.46 53.25,35.33 52.41,34.48 48.17,34.48 D10.3
N$52  (via drill 0.51)
  Top 0.61: IC2.1 52.45,42.55 v52.5,42.5
  Bottom 0.61: v52.5,42.5 51.75,43.25 44.48,43.25 D10.12
N$53
  Top 0.61: IC2.5 47.37,44.52 48.92,46.08 D10.9
N$54  (via drill 0.51)
  Top 0.61: IC2.6 46.09,44.41 v46,44.5
  Bottom 0.61: v46,44.5 50.23,44.5 D10.8
N$121  (3 unrouted)
  Top 1.5: Q1.C 92,30.5 | D13.A 18.5,14.22 18.5,11.5
  Top 2: 92,30.5 92.93,30.5 93.93,29.5 93.93,27 92.5,25.56 88.56,25.56 86.5,23.5 86.5,13 | 38,11.5 70,11.5 | 70,11.5 85,11.5 | 85,11.5 86.5,13 | 85,11.5 D14.A 88,11.5 86.5,13 | RL2.2. 38,11.5 | RL1.2. 9.5,14.25 12.25,11.5 18.5,11.5 38,11.5 | RL3.2. 70.5,12 70,11.5
R_LED  (via drill 0.51)
  Top 0.38: U2.28 67.28,39.73 65.52,41.48 65.52,41.98
  Top 0.61: 65.52,41.98 65.52,45.18 63.02,47.68 63.02,57.98 v63,58
  Bottom 0.61: LED4.A 40.64,68.23 43.22,65.64 55.35,65.64 v63,58
RA  (via drill 0.51)
  Top 0.38: U2.8 71.83,28.81 72.43,28.2 72.43,27.5
  Top 0.61: v23,31 D3.A | R20.1 v23,31 | v72,22.5 72.43,22.93 72.43,27.5 | CT1.2 15.5,22.6 15.5,32 17,33.5 22,33.5 23,32.5 v23,31
  Bottom 0.61: v23,31 24.5,29.5 48.58,29.5 56.37,21.71 71.21,21.71 v72,22.5
RELAY
  Top 0.38: U2.16 75.08,40.02 76.45,41.4
  Top 0.61: 76.45,41.4 81.5,41.4 R32.2
RF  (via drill 0.51)
  Top 0.61: V1.2 2.5,68.5 R5.2
  Top 2: v15.95,2.25 | v15.95,2.25 F1.2
  Bottom 1: V1.2 2.75,65 | 2.75,65 2.75,31 9.45,24.3 9.45,8.75 v15.95,2.25 | TR1.5 55.5,76 24,76 13,65 2.75,65
RV  (via drill 0.51)
  Top 0.38: U2.12 74.42,29.85 76.4,27.88 76.4,27.5
  Top 0.61: v40,25.5 40,28.77 32.76,36.01 6.44,36.01 D1.C 2.1,40.35 C1.2 R15.1 R14.2 R11.1 | v76,18.5 76.4,18.9 76.4,27.5
  Bottom 0.61: v40,25.5 40,20.7 44.7,16 50.5,16 52.24,17.74 75.24,17.74 v76,18.5
S_LED
  Top 0.38: U2.4 69.22,29.23 68.47,28.47 68.47,27.5
  Top 0.61: LED2.A 48,23.19 50.68,20.51 63.8,20.51 68.47,25.18 68.47,27.5
SCF
  Top 0.38: U2.7 71.17,28.5 71.44,28.23 71.44,27.5
  Top 0.61: D6.1 23,21.5 | 23,21.5 R23.2 | 23,21.5 23.05,21.45 D7.C 23.83,17.22 44.78,17.22 46,16 50,16 51.54,17.54 65.03,17.54 71.44,23.95 71.44,27.5
STOP  (1 unrouted)
  Top 0.38: U2.3 68.58,29.57 67.48,28.48 67.48,27.5
  Top 0.61: SW2.P$4 52.16,21.5 63.39,21.5 67.48,25.59 67.48,27.5
UPDI  (via drill 0.51)
  Top 0.38: 74.43,42 74.43,41.69 73.12,40.38 U2.19
  Top 0.61: 74.43,42 74.43,43.5 75.43,44.5 v75.5,44.5
  Bottom 0.61: v75.5,44.5 76,45 76,49 J1.1
V_DIS  (via drill 0.51)
  Top 0.38: U2.25 69.22,40.77 68.49,41.51 68.49,42
  Top 0.61: IC2.3 49.91,41.69 51.59,40.01 56.13,40.01 58.13,38 v60.5,38 | 68.49,42 68.49,47.01 v68,47.5 67,48.5 R24.1
  Bottom 0.61: v68,47.5 68,39 67.2,38.2 v60.5,38
V_SCK  (via drill 0.51)
  Top 0.38: 69.48,42 69.48,41.43 69.88,41.04 U2.24
  Top 0.61: IC2.2 51.17,41.83 52,41 57.04,41 58.53,39.5 v60.5,39.5 | 70,48.4 69.48,47.88 69.48,42 | R26.1 70,48.4 | v69,48.5 69.9,48.5 70,48.4
  Bottom 0.61: v69,48.5 68.86,48.64 67.53,48.64 66.44,47.56 66.44,40.56 66.5,40.5 65.5,39.5 v60.5,39.5
VCC  (via drill 0.51)  (1 unrouted)
  Top 0.38: 73.44,42 73.44,41.61 72.47,40.65 U2.20 72.47,34.48 71.6,33.6 C11.2 | U2.14 75.72,33.23 76,33.5 78.6,33.5
  Top 0.61: IC3.10 44.83,56.17 44,57 41.4,57 C12.2 | IC2.10 44.83,39.67 44.5,40 40.9,40 C13.2 40.12,39.22 | v74.5,45.5 73.44,44.44 73.44,42
  Top 0.813: 78.6,33.5 C10.2 80.4,33.6 v80.5,33.5 | R24.2 R26.2 R25.2 R27.2 77.5,54.9 78,54.4 78,49.5 78.5,49 81.46,49 82.73,50.27 C7.+
  Top 1: C7.+ 85.72,50.27 D9.C
  Top 1.016: C12.2 39.6,56.6 31.72,48.72 C9.+ 31.5,40.1 32,39.6 C13.2
  Top 1.27: D9.C 87.45,51.55 90.46,48.54 IC1.OUT
  Bottom 0.61: J1.2 75,50.54 75,46 v74.5,45.5
  Bottom 0.813: C9.+ 31.5,36 33.5,34 80,34 v80.5,33.5 80.5,37.5 79.5,38.5 79.5,46 83.77,50.27 C7.+
VEE  (via drill 0.51)  (3 unrouted)
  Top 0.813: R28.1 v29.5,66.5 | X1.2 80.27,72.23 80.7,71.8 D12.C
  Top 1.016: D12.C 80.7,69 81.7,68 91.5,68 92.28,67.22 C5.+
  Top 1.5: D13.C 23.5,14.25 | D14.C 92.2,13.95 RL3.1. | C6.+ 84.77,41.46 IC1.IN 90.5,41.42 D8.C
  Top 2: C4.+ 92.28,62 | 92.28,62 C5.+ | B1.+ 92.08,62.2 92.28,62 | 23.5,14.25 RL1.1.
  Bottom 0.813: C5.+ 92.28,67.22 91.5,68 78.13,68 65.95,55.82 57.06,55.82 51.94,50.7 40.8,50.7 29.5,62 v29.5,66.5
  Bottom 1.5: C6.+ 87.23,39 93.93,39
  Bottom 2: C4.+ 93.93,53.84 93.93,39 93.93,27 92.5,25.56 88.5,25.56 86.5,23.56 86.5,14.5 | RL1.1. 30.75,14.25 33.5,11.5 60,11.5 | 60,11.5 85,11.5 86.5,13 86.5,14.5 | RL3.1. 86.75,14.25 86.5,14.5 | RL2.1. 60,11.5
Y_LED  (via drill 0.51)
  Top 0.38: U2.27 67.92,40.08 66.51,41.49 66.51,42
  Top 0.61: 66.51,42 66.51,45.59 64.01,48.09 64.01,57.39 64.14,57.53 64.14,58.86 v64,59
  Bottom 0.61: LED5.A 49.59,66.64 56.36,66.64 v64,59
YA  (via drill 0.51)
  Top 0.38: U2.9 72.47,29.06 73.42,28.11 73.42,27.5
  Top 0.61: R21.1 v23,28 D4.A | v73,21.5 73.42,21.93 73.42,27.5
  Bottom 0.61: v73,21.5 72.22,20.71 50.81,20.71 50.2,20.1 CT2.2 45.9,20.1 45,21 45,27 44,28 v23,28
YF  (via drill 0.51)
  Top 0.61: V1.1 9.85,61.25 R6.2
  Top 1: V1.1 7.25,65.25 V2.2
  Bottom 1: V1.1 12.25,56.25 18.25,56.25 24,50.5 24,40.5 17,33.5 17,13.5 24.5,6 47.5,6 48.5,5 F2.2
  other vias: 48.5,2.25
YV  (via drill 0.51)
  Top 0.38: U2.11 73.78,29.59 75.41,27.96 75.41,27.5
  Top 0.61: D1.A 9,40 | 9,40 D2.C 16.95,37 33.17,37 41.5,28.67 v41.5,24.5 | 9,40 9.1,40.1 C2.2 R17.1 R16.1 R12.1 | v75,19.5 75.41,19.91 75.41,27.5
  Bottom 0.61: v41.5,24.5 41.5,20.6 45.1,17 50,17 51.73,18.73 74.23,18.73 v75,19.5

### Text on the board
Reference: BT AQ DOL R1